# Altium schematic sheet Sheet1.SchDoc
size A; SheetNumber: 1; SheetTotal: 1
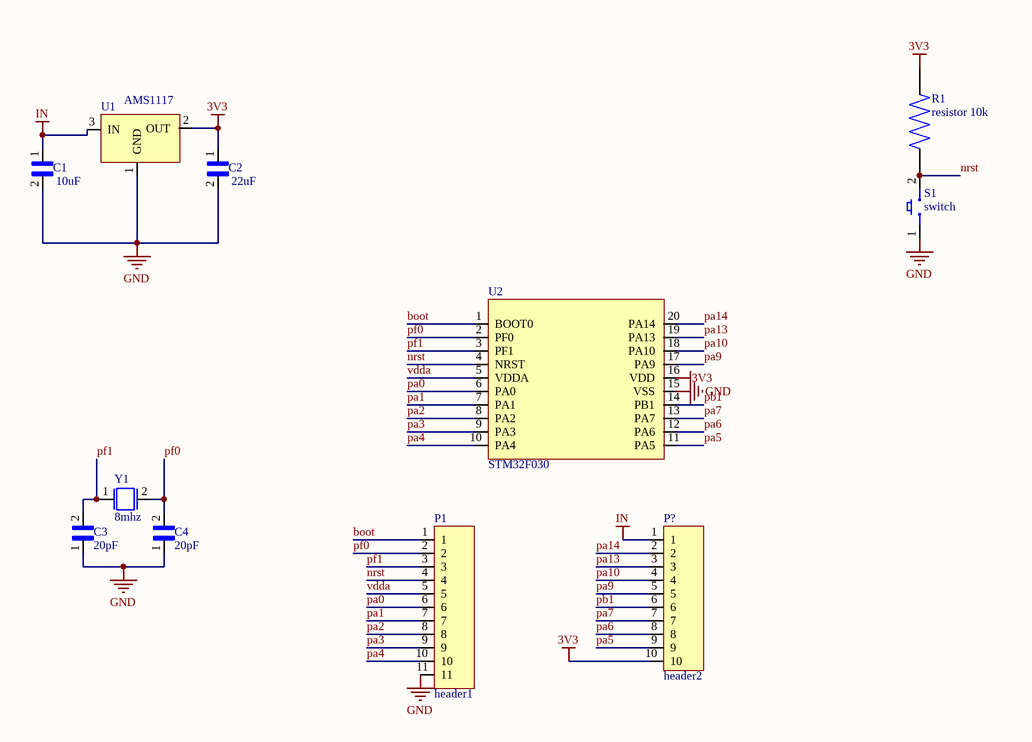
[diagram p0: Sheet1.SchDoc]

## Parts
C1  10uF  [0805 package]
C2  22uF  [0805 package]
C3  20pF  [0805 package]
C4  20pF  [0805 package]
P1  header1  [headers]
P?  header2  [headers 2]
R1  resistor 10k  [0805 package]
S1  switch  [switch]
U1  AMS1117  [AMS1117]
U2  STM32F030  [TSSOP20 package]
Y1  8mhz  [8Mhz oscilator]

## Nets
3V3: C2.1 P?.10 R1.2 U1.2(OUT) U2.16(VDD)
GND: C1.2 C2.2 C3.1 C4.1 P1.11 S1.1 U1.1(GND) U2.15(VSS)
IN: C1.1 P?.1 U1.3(IN)
boot: P1.1 U2.1(BOOT0)
nrst: P1.4 R1.1 S1.2 U2.4(NRST)
pa0: P1.6 U2.6(PA0)
pa1: P1.7 U2.7(PA1)
pa2: P1.8 U2.8(PA2)
pa3: P1.9 U2.9(PA3)
pa4: P1.10 U2.10(PA4)
pa5: P?.9 U2.11(PA5)
pa6: P?.8 U2.12(PA6)
pa7: P?.7 U2.13(PA7)
pa9: P?.5 U2.17(PA9)
pa10: P?.4 U2.18(PA10)
pa13: P?.3 U2.19(PA13)
pa14: P?.2 U2.20(PA14)
pb1: P?.6 U2.14(PB1)
pf0: C4.2 P1.2 U2.2(PF0) Y1.2
pf1: C3.2 P1.3 U2.3(PF1) Y1.1
vdda: P1.5 U2.5(VDDA)

## Library data of the parts
C1 = capacitor 10uF
C2 = capacitor 22uF
C3 C4 = capacitor 20pF
Y1 = 8mhz oscilator